# Altium project GBA CleanLight.PrjPcb
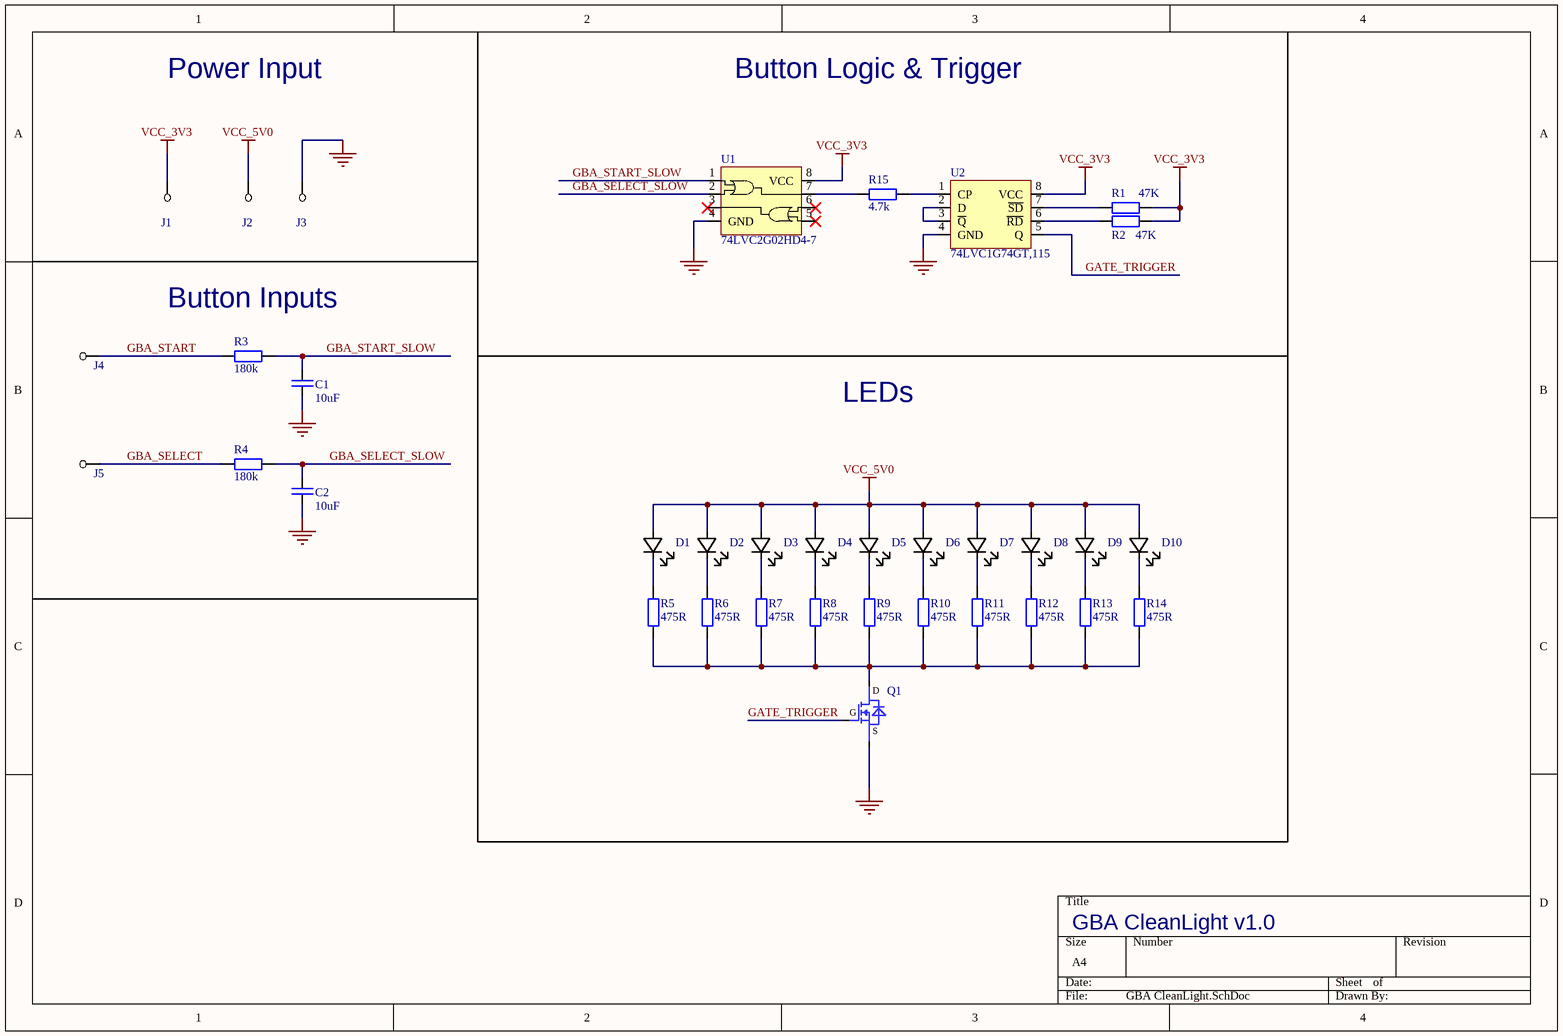
[diagram p0: GBA CleanLight.SchDoc]
1 sheet, 35 parts. Net scope: global (net labels, ports and power ports of the same name join across sheets).
Board file: GBA CleanLight.PcbDoc

## Sheet GBA CleanLight.SchDoc
size A4; SheetNumber: 1; SheetTotal: 1

### Parts
C1  10uF  [C0603]
C2  10uF  [C0603]
D1  GREEN  [LED0603]  (value not drawn)
D2  GREEN  [LED0603]  (value not drawn)
D3  GREEN  [LED0603]  (value not drawn)
D4  GREEN  [LED0603]  (value not drawn)
D5  GREEN  [LED0603]  (value not drawn)
D6  GREEN  [LED0603]  (value not drawn)
D7  GREEN  [LED0603]  (value not drawn)
D8  GREEN  [LED0603]  (value not drawn)
D9  GREEN  [LED0603]  (value not drawn)
D10  GREEN  [LED0603]  (value not drawn)
J1  SP  [SP2]  (value not drawn)  (no BOM)
J2  SP  [SP2]  (value not drawn)  (no BOM)
J3  SP  [SP2]  (value not drawn)  (no BOM)
J4  SP  [SP2]  (value not drawn)  (no BOM)
J5  SP  [SP2]  (value not drawn)  (no BOM)
Q1  SI1012X-T1-GE3  [SC-89-3]  (value not drawn)
R1  47K  [R0402]
R2  47K  [R0402]
R3  180k  [R0402]
R4  180k  [R0402]
R5  475R  [R0402]
R6  475R  [R0402]
R7  475R  [R0402]
R8  475R  [R0402]
R9  475R  [R0402]
R10  475R  [R0402]
R11  475R  [R0402]
R12  475R  [R0402]
R13  475R  [R0402]
R14  475R  [R0402]
R15  4.7k  [R0402]
U1  74LVC2G02HD4-7  [X2-DFN2010-8 (XSON-8 SOT833-1)]
U2  74LVC1G74GT,115  [X2-DFN2010-8 (XSON-8 SOT833-1)]

### Nets
GND: C1.1 C2.1 J3.1 Q1.2(S) U1.4(GND) U2.4(GND)
VCC_3V3: J1.1 R1.2 R2.2 U1.8(VCC) U2.8(VCC)
VCC_5V0: D1.A D2.A D3.A D4.A D5.A D6.A D7.A D8.A D9.A D10.A J2.1
GATE_TRIGGER: Q1.1(G) U2.5(Q)
GBA_SELECT: J5.1 R4.1
GBA_SELECT_SLOW: C2.2 R4.2 U1.2(1B)
GBA_START: J4.1 R3.1
GBA_START_SLOW: C1.2 R3.2 U1.1(1A)
NetD1_K: D1.K R5.2
NetD2_K: D2.K R6.2
NetD3_K: D3.K R7.2
NetD4_K: D4.K R8.2
NetD5_K: D5.K R9.2
NetD6_K: D6.K R10.2
NetD7_K: D7.K R11.2
NetD8_K: D8.K R12.2
NetD9_K: D9.K R13.2
NetD10_K: D10.K R14.2
NetQ1_3: Q1.3(D) R5.1 R6.1 R7.1 R8.1 R9.1 R10.1 R11.1 R12.1 R13.1 R14.1
NetR1_1: R1.1 U2.7(~{SD})
NetR2_1: R2.1 U2.6(~{RD})
NetR15_1: R15.1 U1.7(1Y)
NetR15_2: R15.2 U2.1(CP)
NetU2_2: U2.2(D) U2.3(~{Q})

Not connected (* = marked no-connect by the designer): U1 3(2Y)* 5(2A)* 6(2B)*

### Notes on the sheet
- Power Input
- Button Logic & Trigger
- Button Inputs
- LEDs
- GBA CleanLight v1.0

### Library data of the parts
C1 C2 = CAP_10UF_0603: MURATA - GRM188C81C106MA73D - SMD Multilayer Ceramic Capacitor, 10 µF, 16 V, 0603 [1608 Metric], ± 20%, X6S, GRM Series - SMD Multilayer Ceramic Capacitor, 10 µF, 16 V, 0603 [1608 Metric], ± 20%, X6S, GRM Series; Voltage Rating: 16V; Supplier 1: Digi-Key; Manufacturer: Murata; Manufacturer Part Number: GRM188C81C106MA73D; RoHS: Yes; Category: Ceramic Capacitors; Stock 1: 58218; Pricing 1: 1=0.36000, 10=0.24600, 50=0.16420, 100=0.13960, 500=0.09854, 1000=0.08622 (USD); Mount: Surface Mount; Case/Package: 0603; Case Code (Metric): 1608; Case Code (Imperial): 0603; Material: Ceramic; Weight: 0.000222oz; Min Operating Temperature: -55°C; Max Operating Temperature: 105°C; Package Quantity: 4000; Packaging: Tape and Reel; Capacitance: 10uF; Tolerance: 20%; Dielectric: X6S; Voltage: 16V; Termination: SMD/SMT; Resistor Type: Ceramic; Voltage Rating (DC): 16V; Series: GRM; Length: 1.6mm; Width: 0.8mm; Height: 0.8mm; Thickness: 0.031inch; Depth: 0.8mm; REACH SVHC: No SVHC; Lead Free: Lead Free; RoHS Compliant: Yes; ComponentLink1URL: https://datasheet.ciiva.com/14906/partnumbering-e-01-14906455.pdf?src-supplier=Digi-Key; ComponentLink1Description: https://datasheet.ciiva.com/14906/partnumbering-e-01-14906455.pdf?src-supplier=Digi-Key; ComponentLink2URL: https://datasheet.ciiva.com/14906/partnumbering-e-01-14906457.pdf?src-supplier=Digi-Key; ComponentLink2Description: https://datasheet.ciiva.com/14906/partnumbering-e-01-14906457.pdf?src-supplier=Digi-Key; Supplier Part Number 1: 490-7198-1-ND
D1-D10 = LED_0603_GREEN: LED Green Clear 0603; Manufacturer: Lite-On Inc.; Manufacturer Part Number: LTST-C191KGKT; Wavelength - Dominant: 571nm; Wavelength - Peak: 574nm; Millicandela Rating: 35mcd; Voltage - Forward (Vf) (Typ): 2V; Current - Test: 20mA; Viewing Angle: 130°; Lens Color: Colorless; Lens Style/Size: Rectangle with Flat Top, 1.10mm x 0.80mm; Supplier 1: Digi-Key; RoHS: RoHS Compliant; Category: Optoelectronics; Stock 1: 668117; Pricing 1: 1=0.2, 10=0.157, 100=0.0857, 250=0.05712, 500=0.04856, 1000=0.03713, 2500=0.03356 (GBP); Packaging: Cut Tape (CT); Color: Green; Lens Transparency: Clear; Package / Case: 0603 (1608 Metric); Supplier Device Package: *; Size / Dimension: 1.60mm L x 0.80mm W; Height (Max): 0.55mm; Mounting Type: Surface Mount; ComponentLink1URL: http://optoelectronics.liteon.com/upload/download/DS22-2000-228/S_110_LTST-C191KGKT.pdf; ComponentLink1Description: http://optoelectronics.liteon.com/upload/download/DS22-2000-228/S_110_LTST-C191KGKT.pdf; Supplier Part Number 1: 160-1446-1-ND
J1-J5 = SP: Solder pad
Q1 = SI1012X-T1-GE3: MOSFET N-CH 20V 500MA SC89-3; Manufacturer: Vishay Siliconix; Rise Time: 5ns; Rds On Max: 700mR; Number of Elements: 1; Max Power Dissipation: 250mW; Gate to Source Voltage (Vgs): 6V; Turn-Off Delay Time: 25ns; Threshold Voltage: 900mV; Element Configuration: Single; Polarity: N-CHANNEL; Supplier 1: Digi-Key; Manufacturer Part Number: SI1012X-T1-GE3; RoHS: Yes; Category: MOSFETs; Stock 1: 35583; Pricing 1: 1=0.54000, 10=0.41600, 25=0.39720, 100=0.24950, 500=0.23100, 1000=0.15708 (USD); Mount: Surface Mount; Case/Package: SC; Number of Pins: 3; Weight: 0.001058oz; Contact Plating: Tin,Matte; Min Operating Temperature: -55°C; Max Operating Temperature: 150°C; Packaging: Tape and Reel; Package Quantity: 3000; Drain to Source Voltage (Vdss): 20V; Continuous Drain Current (ID): 500mA; Drain to Source Breakdown Voltage: 20V; Drain to Source Resistance: 700mR; Fall Time: 5ns; Turn-On Delay Time: 5ns; Power Dissipation: 250mW; Number of Channels: 1; On-State Resistance: 700mR; Series: TrenchFET®; Drain-source On Resistance-Max: 700mR; Length: 1.7mm; Width: 0.95mm; Height: 0.8mm; Radiation Hardening: No; REACH SVHC: Unknown; Lead Free: Lead Free; RoHS Compliant: Yes; ComponentLink1URL: https://datasheet.ciiva.com/26140/71166-26140614.pdf?src-supplier=Avnet+Europe; ComponentLink1Description: https://datasheet.ciiva.com/26140/71166-26140614.pdf?src-supplier=Avnet+Europe; ComponentLink2URL: https://datasheet.ciiva.com/11161/71166-11161416.pdf?src-supplier=Avnet; ComponentLink2Description: https://datasheet.ciiva.com/11161/71166-11161416.pdf?src-supplier=Avnet; ComponentLink3URL: https://datasheet.ciiva.com/931/71166-931866.pdf?src-supplier=Digi-Key; ComponentLink3Description: https://datasheet.ciiva.com/931/71166-931866.pdf?src-supplier=Digi-Key; ComponentLink4URL: https://datasheet.ciiva.com/931/71166-931867.pdf?src-supplier=Digi-Key; ComponentLink4Description: https://datasheet.ciiva.com/931/71166-931867.pdf?src-supplier=Digi-Key; ComponentLink5URL: https://datasheet.ciiva.com/931/71166-931868.pdf?src-supplier=Digi-Key; ComponentLink5Description: https://datasheet.ciiva.com/931/71166-931868.pdf?src-supplier=Digi-Key; Supplier Part Number 1: SI1012X-T1-GE3CT-ND
R1 R2 = RES_47K_0402: Resistor 47K 1% 0.063W 0402; Manufacturer: Yageo; Manufacturing Part Number: RC0402FR-0747KL; Resistance (Ohms): 34k; Power (Watts): 0.063W, 1/16W; Temperature Coefficient: ±100ppm/°C; RoHS: RoHS Compliant; Category: Resistors; Stock 1: 0; Pricing 1: 10000=0.00085, 30000=0.00074, 50000=0.00068, 100000=0.00067 (GBP); Packaging: Tape & Reel (TR); Tolerance: ±1%; Composition: Thick Film; Features: Moisture Resistant; Operating Temperature: -55°C ~ 155°C; Package / Case: 0402 (1005 Metric); Supplier Device Package: 0402; Size / Dimension: 0.039" L x 0.020" W (1.00mm x 0.50mm); Height: 0.016" (0.40mm); Number of Terminations: 2; ComponentLink1URL: http://www.yageo.com/documents/recent/PYu-RC_Group_51_RoHS_L_04.pdf; ComponentLink1Description: http://www.yageo.com/documents/recent/PYu-RC_Group_51_RoHS_L_04.pdf; Supplier 1: Digi-Key; Supplier Part Number 1: 311-47.0KLRCT-ND
R3 R4 = RES_180K_0402: Thick Film Resistors 180K OHM 1%; Manufacturer: Yageo; Manufacturer Part Number: RC0402FR-07180KL; Power Rating: 63mW; Temperature Coefficient: 100ppm/°C; Resistance: 180kR; Voltage Rating: 50V; Supplier 1: Digi-Key; RoHS: Yes; Category: Chip SMD Resistors; Stock 1: 137008; Pricing 1: 1=0.10000, 10=0.01600, 100=0.00660, 1000=0.00299, 2500=0.00259, 5000=0.00214 (USD); Case/Package: 0402; Case Code (Imperial): 0402; Case Code (Metric): 1005; Size Code: 0402; Min Operating Temperature: -55°C; Max Operating Temperature: 155°C; Tolerance: 1%; Packaging: Tape and Reel; Termination: SMD/SMT; Resistor Type: Thick Film; Features: Moisture Resistant; Series: RC; Max Power Dissipation: 63mW; Number of Terminations: 2; Construction: Rectangular; Resistance Tolerance: 1%; Length: 1mm; Depth: 0.5mm; RoHS Compliant: Yes; REACH SVHC: Unknown; Military Standard: Not; Lead Free: Lead Free; ComponentLink1URL: https://datasheet.ciiva.com/7983/1018594-7983497.pdf?src-supplier=Element14; ComponentLink1Description: https://datasheet.ciiva.com/7983/1018594-7983497.pdf?src-supplier=Element14; ComponentLink2URL: https://datasheet.ciiva.com/7849/1018594-7849851.pdf?src-supplier=Element14; ComponentLink2Description: https://datasheet.ciiva.com/7849/1018594-7849851.pdf?src-supplier=Element14; ComponentLink3URL: https://datasheet.ciiva.com/7849/1018594-7849852.pdf?src-supplier=Element14; ComponentLink3Description: https://datasheet.ciiva.com/7849/1018594-7849852.pdf?src-supplier=Element14; ComponentLink4URL: https://datasheet.ciiva.com/17025/pyu-rc0402-51-rohs-l-6-r-17025693.pdf?src-supplier=Future+Electronics; ComponentLink4Description: https://datasheet.ciiva.com/17025/pyu-rc0402-51-rohs-l-6-r-17025693.pdf?src-supplier=Future+Electronics; ComponentLink5URL: https://datasheet.ciiva.com/12656/pyu-rc0402-51-rohs-l-6-r-12656911.pdf?src-supplier=Mouser; ComponentLink5Description: https://datasheet.ciiva.com/12656/pyu-rc0402-51-rohs-l-6-r-12656911.pdf?src-supplier=Mouser; Supplier Part Number 1: 311-180KLRCT-ND
R5-R14 = RES_475R_0402: Resistor 475R 0.063W 0402; Manufacturer: Yageo; Manufacturer Part Number: RC0402FR-07475RL; Resistance (Ohms): 475; Tolerance: ±1%; Power (Watts): 0.063W, 1/16W; Temperature Coefficient: ±100ppm/°C; Supplier 1: Digi-Key; RoHS: RoHS Compliant; Category: Resistors; Stock 1: 50000; Pricing 1: 10000=0.00095, 30000=0.00083, 50000=0.00077, 100000=0.00075 (GBP); Packaging: Tape & Reel (TR); Composition: Thick Film; Features: Moisture Resistant; Operating Temperature: -55°C ~ 155°C; Package / Case: 0402 (1005 Metric); Supplier Device Package: 0402; Size / Dimension: 0.039" L x 0.020" W (1.00mm x 0.50mm); Height: 0.016" (0.40mm); Number of Terminations: 2; ComponentLink1URL: http://www.yageo.com/documents/recent/PYu-RC_Group_51_RoHS_L_04.pdf; ComponentLink1Description: http://www.yageo.com/documents/recent/PYu-RC_Group_51_RoHS_L_04.pdf; Supplier Part Number 1: 311-475LRTR-ND
R15 = RES_4K7_0402: Resistor 4.7k 0.063W 0402; Manufacturer: Yageo; Manufacturer Part Number: RT0402BRD074K7L; Tolerance: ±0.1%; Power (Watts): 0.063W, 1/16W; Temperature Coefficient: ±25ppm/°C; Supplier 1: Digi-Key; RoHS: RoHS Compliant; Category: Resistors; Stock 1: 7559; Pricing 1: 1=0.26, 10=0.201, 25=0.1528, 100=0.0844, 250=0.07128, 500=0.0611, 1000=0.04655, 2500=0.04364, 5000=0.03928 (GBP); Packaging: Cut Tape (CT); Resistance (Ohms): 4.7k; Composition: Thin Film; Features: Moisture Resistant; Operating Temperature: -55°C ~ 155°C; Package / Case: 0402 (1005 Metric); Supplier Device Package: 0402; Size / Dimension: 0.039" L x 0.020" W (1.00mm x 0.50mm); Height: 0.014" (0.35mm); Number of Terminations: 2; ComponentLink1URL: http://www.yageo.com/documents/recent/PYu-RT_1-to-0.05_RoHS_L_6.pdf; ComponentLink1Description: http://www.yageo.com/documents/recent/PYu-RT_1-to-0.05_RoHS_L_6.pdf; Supplier Part Number 1: YAG1446CT-ND
U1 = 74LVC2G02HD4-7: 74LVC Series 5.5 V 32 mA Surface Mount Dual 2-Input NOR Gate - XFDFN-8; Manufacturer: Diodes; Number of Circuits: 2; Quiescent Current: 40uA; High Level Output Current: 32mA; Propagation Delay: 5.5ns; Supplier 1: Digi-Key; Manufacturer Part Number: 74LVC2G02HD4-7; RoHS: Yes; Category: Logic Gates; Stock 1: 3063; Pricing 1: 1=0.50000, 10=0.37100, 25=0.32440, 100=0.20980, 250=0.17372, 500=0.13896, 1000=0.10654, 2500=0.09264 (USD); Mount: Surface Mount; Number of Pins: 8; Min Operating Temperature: -40°C; Max Operating Temperature: 125°C; Logic Function: NOR GATE; Packaging: Cut Tape; Number of Inputs: 2; Low Level Output Current: 32mA; RoHS Compliant: Yes; ComponentLink1URL: https://www.diodes.com/assets/Datasheets/74LVC2G02.pdf?src-supplier=Digi-Key; ComponentLink1Description: https://www.diodes.com/assets/Datasheets/74LVC2G02.pdf?src-supplier=Digi-Key; Supplier Part Number 1: 74LVC2G02HD4-7DICT-ND
U2 = 74LVC1G74GT,115: 74LVC1G74 - Single D-type flip-flop with set and reset; positive-edge trigger; Manufacturer: Nexperia; Supplier 1: Digi-Key; Manufacturer Part Number: 74LVC1G74GT,115; RoHS: Yes; Category: Latches and Flip Flops; Stock 1: 21229; Pricing 1: 1=0.51000, 10=0.38400, 25=0.34640, 100=0.23930, 250=0.20148, 500=0.16370, 1000=0.12593, 2500=0.11334 (USD); RoHS Compliant: Yes; ComponentLink1URL: https://assets.nexperia.com/documents/data-sheet/74LVC1G74.pdf?src-supplier=Digi-Key; ComponentLink1Description: https://assets.nexperia.com/documents/data-sheet/74LVC1G74.pdf?src-supplier=Digi-Key; Supplier Part Number 1: 1727-3558-1-ND